# Altium schematic sheet Output_Buffer.SchDoc: Title
size 431 x 279 mm; Date: *******; ApprovedBy: *******; CheckedBy: Dahami Fernando; Author: *******; CompanyName: *******; DrawnBy: Rivikula Fernando; Engineer: *******; Organization: *******; Address1: *******; Address2: *******; Address3: *******; Address4: *******; DocumentNumber: 6; Revision: *******; SheetNumber: 6; SheetTotal: 7; Subtitle: Output buffer; Project: Distotion_Gitar_Pedal; VersionRevision: 1; TotalSheet: 8; CurrentTime: *******; CurrentDate: *******; Time: *******; DocumentFullPathAndName: *******; DocumentName: *******; ModifiedDate: *******; ImagePath: *******; ProjectName: *******; Application_BuildNumber: *******
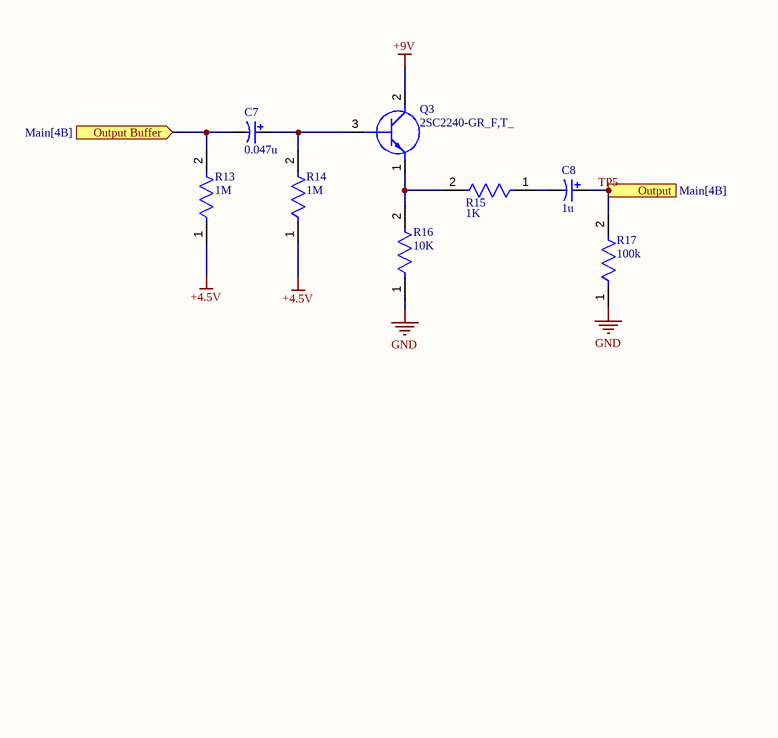
[diagram p0: Output_Buffer.SchDoc]

## Parts
C7  0.047u  [CAPPR55-200-1100X500X1200]
C8  1u  [CAPPR55-200-1100X500X1200]
Q3  2SC2240-GR_F,T_  [SSM3K7002CFULF]
R13  1M  [FP-MRS1600-MFG]
R14  1M  [FP-MRS1600-MFG]
R15  1K  [FP-MRS1600-MFG]
R16  10K  [FP-MRS1600-MFG]
R17  100k  [FP-MRS1600-MFG]

## Ports
Output (out, see Main[4B]), Output Buffer (in, see Main[4B])

## Nets
+4.5V: R13.1 R14.1
+9V: Q3.2(C)
GND: R16.1 R17.1
Output Buffer: C7.2 R13.2 ; port Output Buffer
TP5: C8.1 R17.2 ; port Output
NetC7_1: C7.1 Q3.3(B) R14.2
NetC8_2: C8.2 R15.1
NetQ3_1: Q3.1(E) R15.2 R16.2

## Notes on the sheet
- DWG. NO.
- REV.
- SHT.
- THIS DOCUMENT AND THE DATA DISCLOSED HEREIN OR HEREWITH IS THE PROPERTY OF ALTIUM LIMITED AND MAY BE FREELY DISTRIBUTED IN WHOLE. NO RIGHTS ARE RESERVED OR EXPRESS OR IMPLIED WARANTEE GIVEN.
- REVISION
- DESCRIPTION
- DATE
- APPROVED
- ENG:
- APPROVALS
- PROJECT
- DSN:
- CHK:
- REFERENCE DOCUMENTS
- PROJECT REVISION:
- TITLE
- DOCUMENT REVISION:
- DESIGN ITEM:
- BOM:
- FAB DWG:
- PCB DWG:
- ASSY DWG:
- SCALE:
- SIZE
- B
- CAGE CODE
- FILE NAME
- DWG NO.
- SHEET
- OF
- REV

## Library data of the parts
C7 C8 = CMP-1665-00036-2: Aluminum Electrolytic Capacitor, 22 uF, +/- 20%, 50 V, -40 to 85 degC, 2-Pin THD, RoHS, Bulk; Manufacturer: Panasonic; Ripple Current: 100mA; Life (Hours): 2000Hour; Voltage: 50V; Dissipation Factor: 0.12%; Leakage Current: 3uA; Lead/Base Style: Straight; Capacitance: 22uF; Lead Diameter: 0.5mm; Max Operating Temperature: 85degC; Height: 11mm; Package Reference: CAPPR55-200-1100X500X1200; Radiation Hardening: No; RoHSCompliant: true; Termination: Radial; Case/Package: Radial; REACH SVHC: NoSVHC; Height - Seated (Max): 0.472inch; Min Operating Temperature: -40degC; Packaging: Bulk; Manufacturer URL: http://www.panasonic.com/; Length: 11mm; Tolerance: 20%; Voltage Rating: 50V; Voltage Rating (DC): 50V; Datasheet URL: https://industrial.panasonic.com/cdbs/www-data/pdf/RDF0000/ABA0000C1218.pdf; Lead Pitch: 2mm; Ripple Current (AC): 100mA; Package Description: 2-Pin Radial Lead, Dia 5 mm, Height 12 mm; Diameter: 5mm; Datasheet Version: Rev. 05, 10/2016; Package Quantity: 200; Mount: ThroughHole
Q3 = 2SC2240-GR_F,T_: Transistor BJT NPN; Manufacturer_Name: Toshiba; Manufacturer_Part_Number: 2SC2240-GR(F,T); Datasheet Link: https://datasheet.octopart.com/2SC2240GR-Toshiba-datasheet-109832.pdf; Mouser Part Number: 757-2SC2240-GRFT; Mouser Price/Stock: https://www.mouser.co.uk/ProductDetail/Toshiba/2SC2240-GRFT?qs=%2FsslhGPpiOR3XjNwkR44HA%3D%3D
R13-R17 = CMP-02408-000019-1: RES 20K OHM 0.4W 1% AXIAL; Max Power Dissipation: 400mW; Temperature Coefficient: 50ppm/°C; Resistance: 20kR; Technology: THIN FILM; Max Operating Temperature: 155°C; Number of Terminations: 2; RoHS Compliant: Yes; Packaging: Tape and Reel; Radiation Hardening: No; Contact Plating: Tin; Military Standard: Not; Construction: Cylindrical; Diameter: 1.6mm; Tolerance: 1%; Mount: Through Hole; Power Rating: 400mW; Case/Package: Conformal; Termination: Axial; Length: 3.6mm; Min Operating Temperature: -55°C; Resistor Type: Metal Film; Series: MRS16